# EAGLE design tempcontrol (EAGLE 5.06)
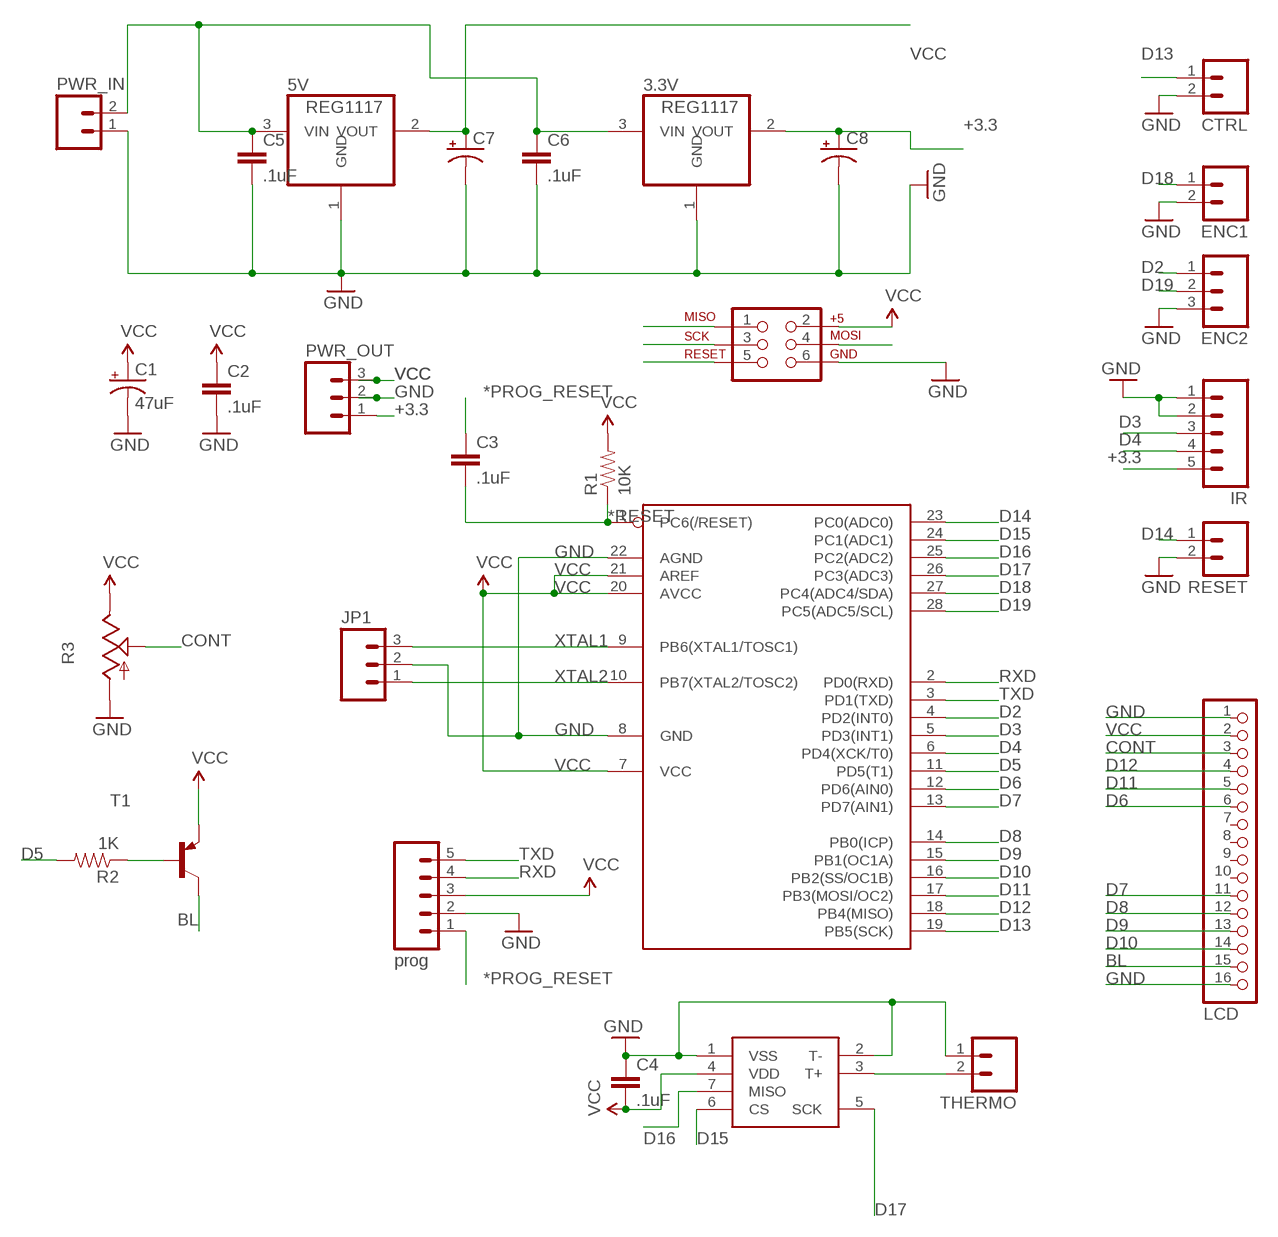
[diagram p0: schematic, sheet 1]

## Parts
3.3V  REG1117  [SOT223]
5V  REG1117  [SOT223]
C1  47uF  CAP_POLPTH2  [CPOL-RADIAL-10UF-25V]
C2  .1uF  CAP0805  [0805]
C3  .1uF  CAP0603-CAP  [0603-CAP]
C4  .1uF  CAP0805  [0805]
C5  .1uF  CAP0805  [0805]
C6  .1uF  CAP0805  [0805]
C7  CAP_POL3528  [EIA3528]
C8  CAP_POL3528  [EIA3528]
CTRL  M02LOCK  [1X02_LOCK]
ENC1  M02LOCK  [1X02_LOCK]
ENC2  M03LOCK  [1X03_LOCK]
IC1  MEGA168-P  MEGA8-P  [DIL28-3]
IR  M05LOCK  [1X05_LOCK]
JP1  M03LOCK  [1X03_LOCK]
JP7  LCD  PINHD-1X16  [1X16]
PROG  prog  M05LOCK  [1X05_LOCK]
PWR_IN  M02LOCK  [1X02_LOCK]
PWR_OUT  M03LOCK  [1X03_LOCK]
R1  10K  RESISTOR  [0805]
R2  1K  RESISTOR  [0805]
R3  TRIM_US-B64Y  [B64Y]
RESET  M02LOCK  [1X02_LOCK]
T1  2N3906-PNP-TO92-EBC  [TO92-EBC]
THERMO  M02LOCK  [1X02_LOCK]
U$1  AVR_SPI_PRG_6NS  [2X3-NS]
U$2  MAX6675  [SO08]

## Nets
*PROG_RESET: C3.1 PROG.1
*RESET: C3.2 IC1.1(PC6(/RESET)) R1.1 U$1.5
+3.3: 3.3V.2(VOUT) C8.A(+) IR.5 PWR_OUT.1
BL: JP7.15 T1.C
CONT: JP7.3 R3.S
D2: ENC2.1 IC1.4(PD2(INT0))
D3: IC1.5(PD3(INT1)) IR.3
D4: IC1.6(PD4(XCK/T0)) IR.4
D5: IC1.11(PD5(T1)) R2.2
D6: IC1.12(PD6(AIN0)) JP7.6
D7: IC1.13(PD7(AIN1)) JP7.11
D8: IC1.14(PB0(ICP)) JP7.12
D9: IC1.15(PB1(OC1A)) JP7.13
D10: IC1.16(PB2(SS/OC1B)) JP7.14
D11: IC1.17(PB3(MOSI/OC2)) JP7.5 U$1.4
D12: IC1.18(PB4(MISO)) JP7.4 U$1.1
D13: CTRL.1 IC1.19(PB5(SCK)) U$1.3
D14: IC1.23(PC0(ADC0)) RESET.1
D15: IC1.24(PC1(ADC1)) U$2.6(CS)
D16: IC1.25(PC2(ADC2)) U$2.7(MISO)
D17: IC1.26(PC3(ADC3)) U$2.5(SCK)
D18: ENC1.1 IC1.27(PC4(ADC4/SDA))
D19: ENC2.2 IC1.28(PC5(ADC5/SCL))
GND: 3.3V.1(GND) 5V.1(GND) C1.2(-) C2.2 C4.1 C5.2 C6.2 C7.C(-) C8.C(-) CTRL.2 ENC1.2 ENC2.3 IC1.8(GND) IC1.22(AGND) IR.1 IR.2 JP1.2 JP7.1 JP7.16 PROG.2 PWR_IN.1 PWR_OUT.2 R3.A RESET.2 THERMO.1 U$1.6 U$2.1(VSS) U$2.2(T-)
N$7: R2.1 T1.B
N$11: 3.3V.3(VIN) 5V.3(VIN) C5.1 C6.1 PWR_IN.2
RXD: IC1.2(PD0(RXD)) PROG.4
T+: THERMO.2 U$2.3(T+)
TXD: IC1.3(PD1(TXD)) PROG.5
VCC: 5V.2(VOUT) C1.1(+) C2.1 C4.2 C7.A(+) IC1.7(VCC) IC1.20(AVCC) IC1.21(AREF) JP7.2 PROG.3 PWR_OUT.3 R1.2 R3.E T1.E U$1.2 U$2.4(VDD)
XTAL1: IC1.9(PB6(XTAL1/TOSC1)) JP1.3
XTAL2: IC1.10(PB7(XTAL2/TOSC2)) JP1.1
Unconnected: JP7.7 JP7.8 JP7.9 JP7.10

## Library data of the parts
3.3V 5V = burr-brown:REG1117: 800mA and 1A Low Dropout (LDO) Positive Regulator 1.8V, 2.5V, 2.85V, 3.3V, 5V, and Adj
C1 C7 C8 = SparkFun:CAP_POL: Capacitor Polarized These are standard SMD and PTH capacitors. Normally 10uF, 47uF, and 100uF in electrolytic and tantalum varieties. Always verify the external diameter of the through hole cap, it varies with capacity, voltage, and manufacturer. The EIA devices should be standard.
C2-C6 = SparkFun:CAP: Capacitor Standard 0603 ceramic capacitor, and 0.1" leaded capacitor.
CTRL ENC1 PWR_IN RESET THERMO = SparkFun:M02: Header 2 Standard 2-pin 0.1" header. Use with straight break away headers (SKU : PRT-00116), right angle break away headers (PRT-00553), swiss pins (PRT-00743), machine pins (PRT-00117), and female headers (PRT-00115). Molex polarized connector foot print use with SKU : PRT-08233 with associated crimp pins and housings.
ENC2 JP1 PWR_OUT = SparkFun:M03: Header 3 Standard 3-pin 0.1" header. Use with straight break away headers (SKU : PRT-00116), right angle break away headers (PRT-00553), swiss pins (PRT-00743), machine pins (PRT-00117), and female headers (PRT-00115). Molex polarized connector foot print use with SKU : PRT-08232 with associated crimp pins and housings.
IC1 = atmel1:MEGA8-P: MICROCONTROLLER 8 Kbytes FLASH 1 kbytes SRAM 512 bytes EEPROM USART 4-channel 10 bit ADC 2-channel 8 bit ADC
IR PROG = SparkFun:M05: Header 5 Standard 5-pin 0.1" header. Use with straight break away headers (SKU : PRT-00116), right angle break away headers (PRT-00553), swiss pins (PRT-00743), machine pins (PRT-00117), and female headers (PRT-00115). Molex polarized connector foot print use with SKU : PRT-08230 with associated crimp pins and housings.
JP7 = pinhead:PINHD-1X16: PIN HEADER
R1 R2 = SparkFun:RESISTOR: Resistor Basic schematic elements and footprints for 0603, 1206, and PTH 1/10th watt (small) resistors.
R3 = pot:TRIM_US-: POTENTIOMETER
T1 = transistor-neu-to92:*-PNP-: PNP Transistror
U$1 = SparkFun:AVR_SPI_PRG_6: AVR ISP 6 Pin This is the reduced ISP connector for AVR programming. Common on Arduino. This footprint will take up less PCB space and can be used with a 10-pin to 6-pin adapter such as SKU: BOB-08508
U$2 = max6675:MAX6675

## Board
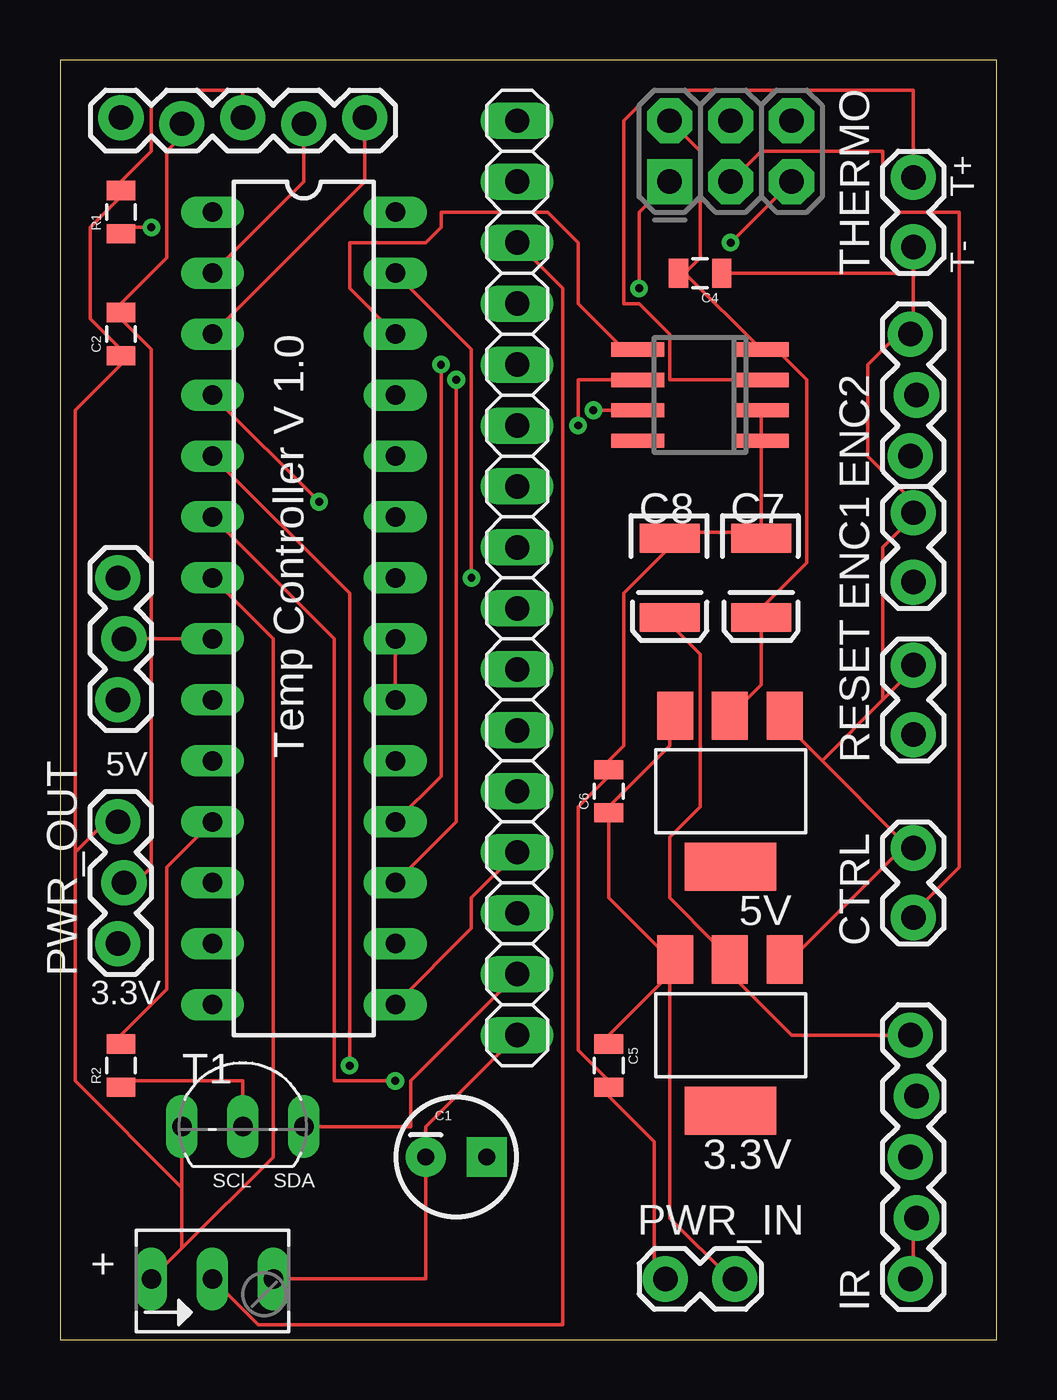
[diagram p1: board, top side]
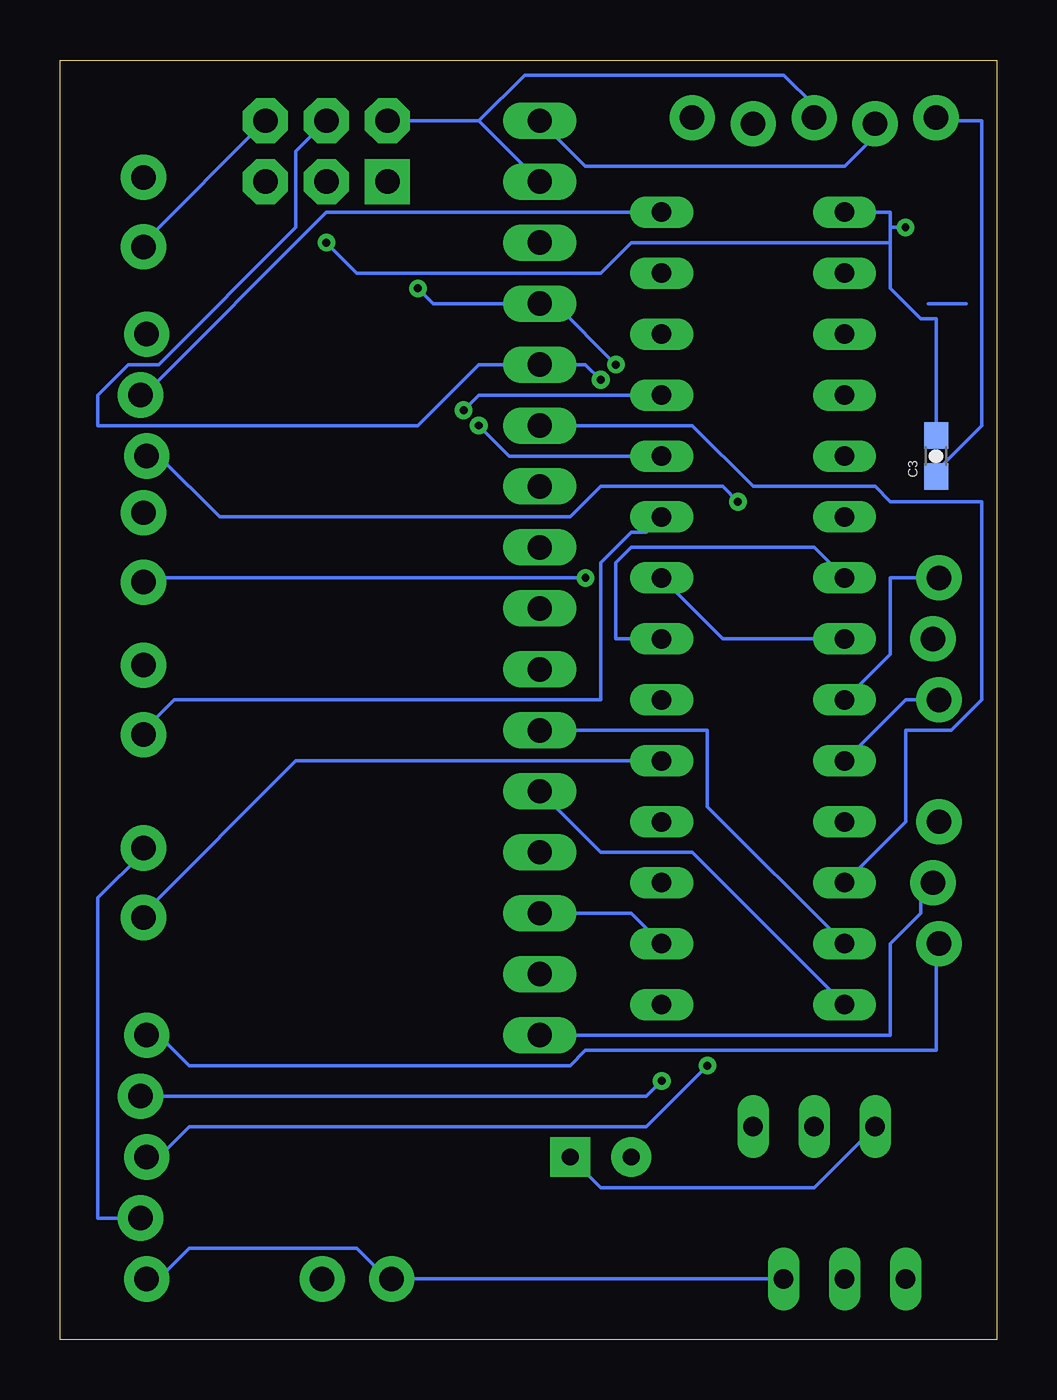
[diagram p2: board, bottom side, seen from below]

Size 39.04 x 53.33 mm. Coordinates in mm from the lower left corner, seen from the top.
Outline: 0,0 39.04,0 39.04,53.33 0,53.33 0,0
Copper layers (1*16): Top 0.0356mm / dielectric 1.5011mm / Bottom 0.0356mm
Design rules "LaenPCBOrder": minimum track width 6mil, minimum drill 13mil, track to track 6mil, track to pad 6mil, pad to pad 6mil, via to via 6mil, smd to smd 6mil, copper to edge 15mil, drill to drill 6mil, minimum pad ring 10mil, minimum via ring 8mil, stop-mask expansion 4mil, vias tented up to drill 0mil, thermal gap 10mil

### Footprints (pad centres in the part's own frame; a part is rotated, then mirrored left to right if it is on the bottom)
SOT223 = smd 1.499 x 2.007: 1 -2.261,-3.15; 2 0.025,-3.15; 3 2.311,-3.15 | smd 3.81 x 2.007: 4 0,3.15
CPOL-RADIAL-10UF-25V = drill 0.7 pad 1.651 square: 1 1.27,0 | drill 0.7 pad 1.651 round: 2 -1.27,0
0805 = smd 0.8 x 1.2: 1 -0.9,0; 2 0.9,0
0603-CAP = smd 1.1 x 1: 1 -0.85,0; 2 0.85,0
EIA3528 = smd 1.2 x 2.5: A 1.65,0; C -1.65,0
1X02_LOCK = drill 1.016 pad 1.88 round: 1 -0.178,0; 2 2.718,0
1X03_LOCK = drill 1.016 pad 1.88 round: 1 0,0.127; 2 2.54,-0.127; 3 5.08,0.127
DIL28-3 = drill 0.813 long: 1 -16.51,-3.81; 2 -13.97,-3.81; 3 -11.43,-3.81; 4 -8.89,-3.81; 5 -6.35,-3.81; 6 -3.81,-3.81; 7 -1.27,-3.81; 8 1.27,-3.81; 9 3.81,-3.81; 10 6.35,-3.81; 11 8.89,-3.81; 12 11.43,-3.81; 13 13.97,-3.81; 14 16.51,-3.81; 15 16.51,3.81; 16 13.97,3.81; 17 11.43,3.81; 18 8.89,3.81; 19 6.35,3.81; 20 3.81,3.81; 21 1.27,3.81; 22 -1.27,3.81; 23 -3.81,3.81; 24 -6.35,3.81; 25 -8.89,3.81; 26 -11.43,3.81; 27 -13.97,3.81; 28 -16.51,3.81
1X05_LOCK = drill 1.016 pad 1.88 round: 1 0,0.127; 2 2.54,-0.127; 3 5.08,0.127; 4 7.62,-0.127; 5 10.16,0.127
1X16 = drill 1.016 long: 1 -19.05,0; 2 -16.51,0; 3 -13.97,0; 4 -11.43,0; 5 -8.89,0; 6 -6.35,0; 7 -3.81,0; 8 -1.27,0; 9 1.27,0; 10 3.81,0; 11 6.35,0; 12 8.89,0; 13 11.43,0; 14 13.97,0; 15 16.51,0; 16 19.05,0
B64Y = drill 0.813 long: A 2.54,0; E -2.54,0; S 0,0
TO92-EBC = drill 0.813 long: B 0,-1.27; C 2.54,-1.27; E -2.54,-1.27
2X3-NS = drill 1.016 pad 1.88 square: 1 -2.54,-1.27 | drill 1.016 pad 1.88 octagon: 2 -2.54,1.27; 3 0,-1.27; 4 0,1.27; 5 2.54,-1.27; 6 2.54,1.27
SO08 = smd 0.6 x 2.2: 1 -1.905,-2.6; 2 -0.635,-2.6; 3 0.635,-2.6; 4 1.905,-2.6; 5 1.905,2.6; 6 0.635,2.6; 7 -0.635,2.6; 8 -1.905,2.6

### Placement (x,y rotation side)
3.3V  27.94,12.7 180 top
5V  27.94,22.86 180 top
C1  16.51,7.62 0 top
C2  2.54,41.91 90 top
C3  2.54,36.83 90 bottom
C4  26.67,44.45 180 top
C5  22.86,11.43 270 top
C6  22.86,22.86 90 top
C7  29.21,31.75 270 top
C8  25.4,31.75 270 top
CTRL  35.56,17.78 90 top
ENC1  35.56,31.75 90 top
ENC2  35.56,36.83 90 top
IC1  10.16,30.48 270 top
IR  35.56,2.54 90 top
JP1  2.54,26.67 90 top
JP7  19.05,31.75 270 top
PROG  2.54,50.8 0 top
PWR_IN  25.4,2.54 0 top
PWR_OUT  2.54,16.51 90 top
R1  2.54,46.99 90 top
R2  2.54,11.43 90 top
R3  6.35,2.54 0 top
RESET  35.56,25.4 90 top
T1  7.62,10.16 0 top
THERMO  35.56,45.72 90 top
U$1  27.94,49.53 0 top
U$2  26.67,39.37 90 top

### Tracks (layer width: path | path; a pad name or v marks a point on that pad's centre or on a via)
*PROG_RESET
  Bottom 0.152: C3.1 2.54,36.2 0.64,38.1 0.64,50.8 2.54,50.8 PROG.1
*RESET  (via drill 0.33)
  Top 0.152: v3.81,46.35 2.54,46.35 R1.1 | v27.94,45.72 U$1.5
  Bottom 0.152: 4.45,46.35 4.45,46.99 IC1.1 | 4.45,45.72 4.45,46.35 | 4.45,45.72 4.45,43.81 3.17,42.55 2.54,42.55 C3.2 | 4.45,46.35 v3.81,46.35 | v27.94,45.72 26.67,44.45 16.51,44.45 15.24,45.72 4.45,45.72
+3.3
  Top 0.152: IR.5 30.48,12.7 27.94,15.24 3.3V.2 27.3,15.88 27.3,16.51 25.4,18.41 25.4,20.95 26.67,22.22 26.67,28.57 25.4,29.84 C8.A
  Bottom 0.152: PWR_OUT.1 2.54,16.51 2.54,12.07 17.14,12.07 17.78,11.43 33.66,11.43 34.92,12.7 IR.5
BL
  Top 0.152: T1.C 14.61,8.89 14.61,10.8 JP7.15
CONT
  Top 0.152: R3.S 8.26,0.64 20.95,0.64 20.95,43.81 JP7.3
D2  (via drill 0.33)
  Top 0.152: IC1.4 v10.79,34.92
  Bottom 0.152: v10.79,34.92 11.43,35.56 16.51,35.56 17.78,34.29 32.38,34.29 34.92,36.83 ENC2.1
D3  (via drill 0.33)
  Top 0.152: IC1.5 12.06,31.11 v12.06,11.43
  Bottom 0.152: v12.06,11.43 14.61,8.89 33.66,8.89 34.92,7.62 IR.3
D4  (via drill 0.33)
  Top 0.152: IC1.6 11.43,29.21 11.43,10.8 v13.97,10.8
  Bottom 0.152: v13.97,10.8 14.61,10.16 IR.4
D5
  Top 0.152: IC1.11 4.45,19.68 4.45,14.61 2.54,12.7 R2.2
D6
  Bottom 0.152: IC1.12 3.81,21.59 3.81,25.4 1.91,25.4 0.64,26.67 0.64,34.92 4.45,34.92 5.08,35.56 10.16,35.56 12.7,38.1 JP7.6
D7
  Bottom 0.152: IC1.13 12.06,22.22 12.06,25.4 JP7.11
D8
  Bottom 0.152: IC1.14 12.7,20.32 16.51,20.32 JP7.12
D9
  Top 0.152: IC1.15 17.14,17.14 17.14,18.41 JP7.13
D10
  Bottom 0.152: IC1.16 15.24,17.78 JP7.14
D11  (via drill 0.33)
  Top 0.152: IC1.17 16.51,21.59 v16.51,40.01
  Bottom 0.152: v16.51,40.01 17.14,40.64 JP7.5 21.59,40.64 24.13,38.1 37.47,38.1 37.47,39.37 36.2,40.64 34.92,40.64 29.21,46.35 29.21,49.53 U$1.4
D12  (via drill 0.33)
  Top 0.152: IC1.18 15.88,23.49 v15.88,40.64 | U$1.1 24.13,46.99 v24.13,43.81
  Bottom 0.152: v15.88,40.64 18.41,43.18 JP7.4 23.5,43.18 v24.13,43.81
D13
  Top 0.152: U$1.3 29.21,49.53 34.29,49.53 34.29,47.62 34.92,46.99 37.47,46.99 37.47,19.68 35.56,17.78 CTRL.1
  Bottom 0.152: IC1.19 29.21,24.13 35.56,17.78 CTRL.1
D14
  Bottom 0.152: IC1.23 14.61,33.66 15.24,33.66 16.51,32.38 16.51,26.67 34.29,26.67 35.56,25.4 RESET.1
D15  (via drill 0.33)
  Top 0.152: v21.59,38.1 21.59,40.01 U$2.6
  Bottom 0.152: v21.59,38.1 20.32,36.83 IC1.24
D16  (via drill 0.33)
  Top 0.152: v22.23,38.73 U$2.7
  Bottom 0.152: v22.23,38.73 21.59,39.37 IC1.25
D17
  Top 0.152: IC1.26 12.06,43.81 12.06,45.72 15.24,45.72 15.88,46.35 15.88,46.99 20.32,46.99 21.59,45.72 21.59,43.18 23.5,41.27 U$2.5
D18  (via drill 0.33)
  Top 0.152: IC1.27 17.14,41.27 v17.14,31.75
  Bottom 0.152: v17.14,31.75 35.56,31.75 ENC1.1
D19
  Bottom 0.152: IC1.28 27.94,46.99 35.56,39.37 ENC2.2
GND
  Top 0.152: PROG.2 5.08,50.16 4.45,49.53 4.45,45.09 2.54,43.18 C2.2 2.54,42.55 3.81,41.27 3.81,29.21 | 3.81,29.21 IC1.8 | 3.81,29.21 JP1.2 | 3.81,29.21 3.81,19.68 3.17,19.05 PWR_OUT.2 | 35.56,44.45 C4.1 | 35.56,44.45 THERMO.1 | 35.56,44.45 35.56,41.91 ENC2.3 34.92,41.91 33.66,40.64 33.66,36.83 35.56,34.92 ENC1.2 35.56,34.29 34.29,33.02 34.29,26.67 | 34.92,20.32 35.56,20.95 CTRL.2 34.92,20.32 | 34.92,20.32 30.48,15.88 3.3V.1 | 31.75,24.13 34.92,20.95 34.92,20.32 | 31.75,24.13 30.48,25.4 5V.1 | 31.75,24.13 34.29,26.67 | 34.29,26.67 35.56,27.94 RESET.2 | R3.A 15.24,2.54 C1.2 15.24,8.89 JP7.16 | 29.21,37.46 29.21,38.73 U$2.2 | 29.21,33.66 25.4,33.66 C8.C 25.4,33.02 23.5,31.11 23.5,24.77 22.86,24.13 C6.2 22.86,23.49 21.59,22.22 21.59,12.07 22.86,10.8 C5.2 22.86,10.16 24.77,8.25 24.77,2.54 PWR_IN.1 | 29.21,33.66 29.21,37.46 | 29.21,37.46 U$2.1 | 29.21,33.66 C7.C | IR.1 35.56,2.54 35.56,5.08 IR.2
  Bottom 0.152: JP7.1 17.14,48.89 6.35,48.89 5.08,50.16 PROG.2 | IC1.22 11.43,29.21 IC1.8 | U$1.6 35.56,45.72 THERMO.1 | IR.1 34.92,2.54 33.66,3.81 26.67,3.81 25.4,2.54 PWR_IN.1 R3.A | CTRL.2 35.56,20.32 37.47,18.41 37.47,5.08 IR.2 | JP7.16 4.45,12.7 4.45,16.51 3.17,17.78 3.17,19.05 PWR_OUT.2
N$2
  Bottom 0.152: 1.27,43.18 2.86,43.18
N$7
  Top 0.152: T1.B 7.62,10.8 2.54,10.8 R2.1
N$11
  Top 0.152: 25.4,15.24 22.86,12.7 C5.1 | 5V.3 25.4,25.4 25.4,24.77 22.86,22.22 C6.1 22.86,18.41 25.4,15.88 3.3V.3 25.4,15.24 | 25.4,15.24 25.4,5.08 27.94,2.54 PWR_IN.2
RXD
  Top 0.152: IC1.2 10.16,48.26 PROG.4
T+
  Top 0.152: U$2.3 25.4,40.01 25.4,41.91 24.13,43.18 23.5,43.18 23.5,50.8 24.77,52.07 35.56,52.07 THERMO.2
TXD
  Top 0.152: IC1.3 12.7,48.26 PROG.5
VCC
  Top 0.152: 5V.2 29.21,27.3 C7.A 29.21,30.48 31.11,32.38 31.11,40.01 29.84,41.27 U$2.4 29.21,41.27 26.04,44.45 | 26.04,44.45 26.67,45.09 26.67,49.53 U$1.2 | 26.04,44.45 C4.2 | PROG.3 7.62,52.07 4.45,52.07 3.81,51.44 3.81,49.53 2.54,48.26 R1.2 2.54,47.62 1.27,46.35 1.27,42.55 2.54,41.27 C2.1 2.54,40.64 0.64,38.73 0.64,20.32 | IC1.21 IC1.20 | R3.E 5.08,3.81 | 5.08,6.35 T1.E | 5.08,3.81 5.08,6.35 | 0.64,20.32 1.91,21.59 PWR_OUT.3 | 0.64,20.32 0.64,10.8 5.08,6.35 | IC1.7 8.89,29.21 8.89,7.62 5.08,3.81
  Bottom 0.152: 21.59,50.8 JP7.2 | 21.59,50.8 U$1.2 | IC1.7 7.62,33.02 15.24,33.02 15.88,32.38 15.88,29.21 IC1.21 | C1.1 16.51,6.35 7.62,6.35 T1.E | 21.59,50.8 19.68,52.7 8.89,52.7 7.62,51.44 PROG.3
XTAL1
  Bottom 0.152: IC1.9 4.45,28.57 4.45,31.75 JP1.3
XTAL2
  Bottom 0.152: IC1.10 3.81,26.67 JP1.1

### Text on the board
tNames: T+ | T- | Temp Controller V 1.0 | 5V | 3.3V | SCL | SDA | +